# Altium schematic sheet MCU_Build.SchDoc
size A3; SheetNumber: 1; SheetTotal: 2
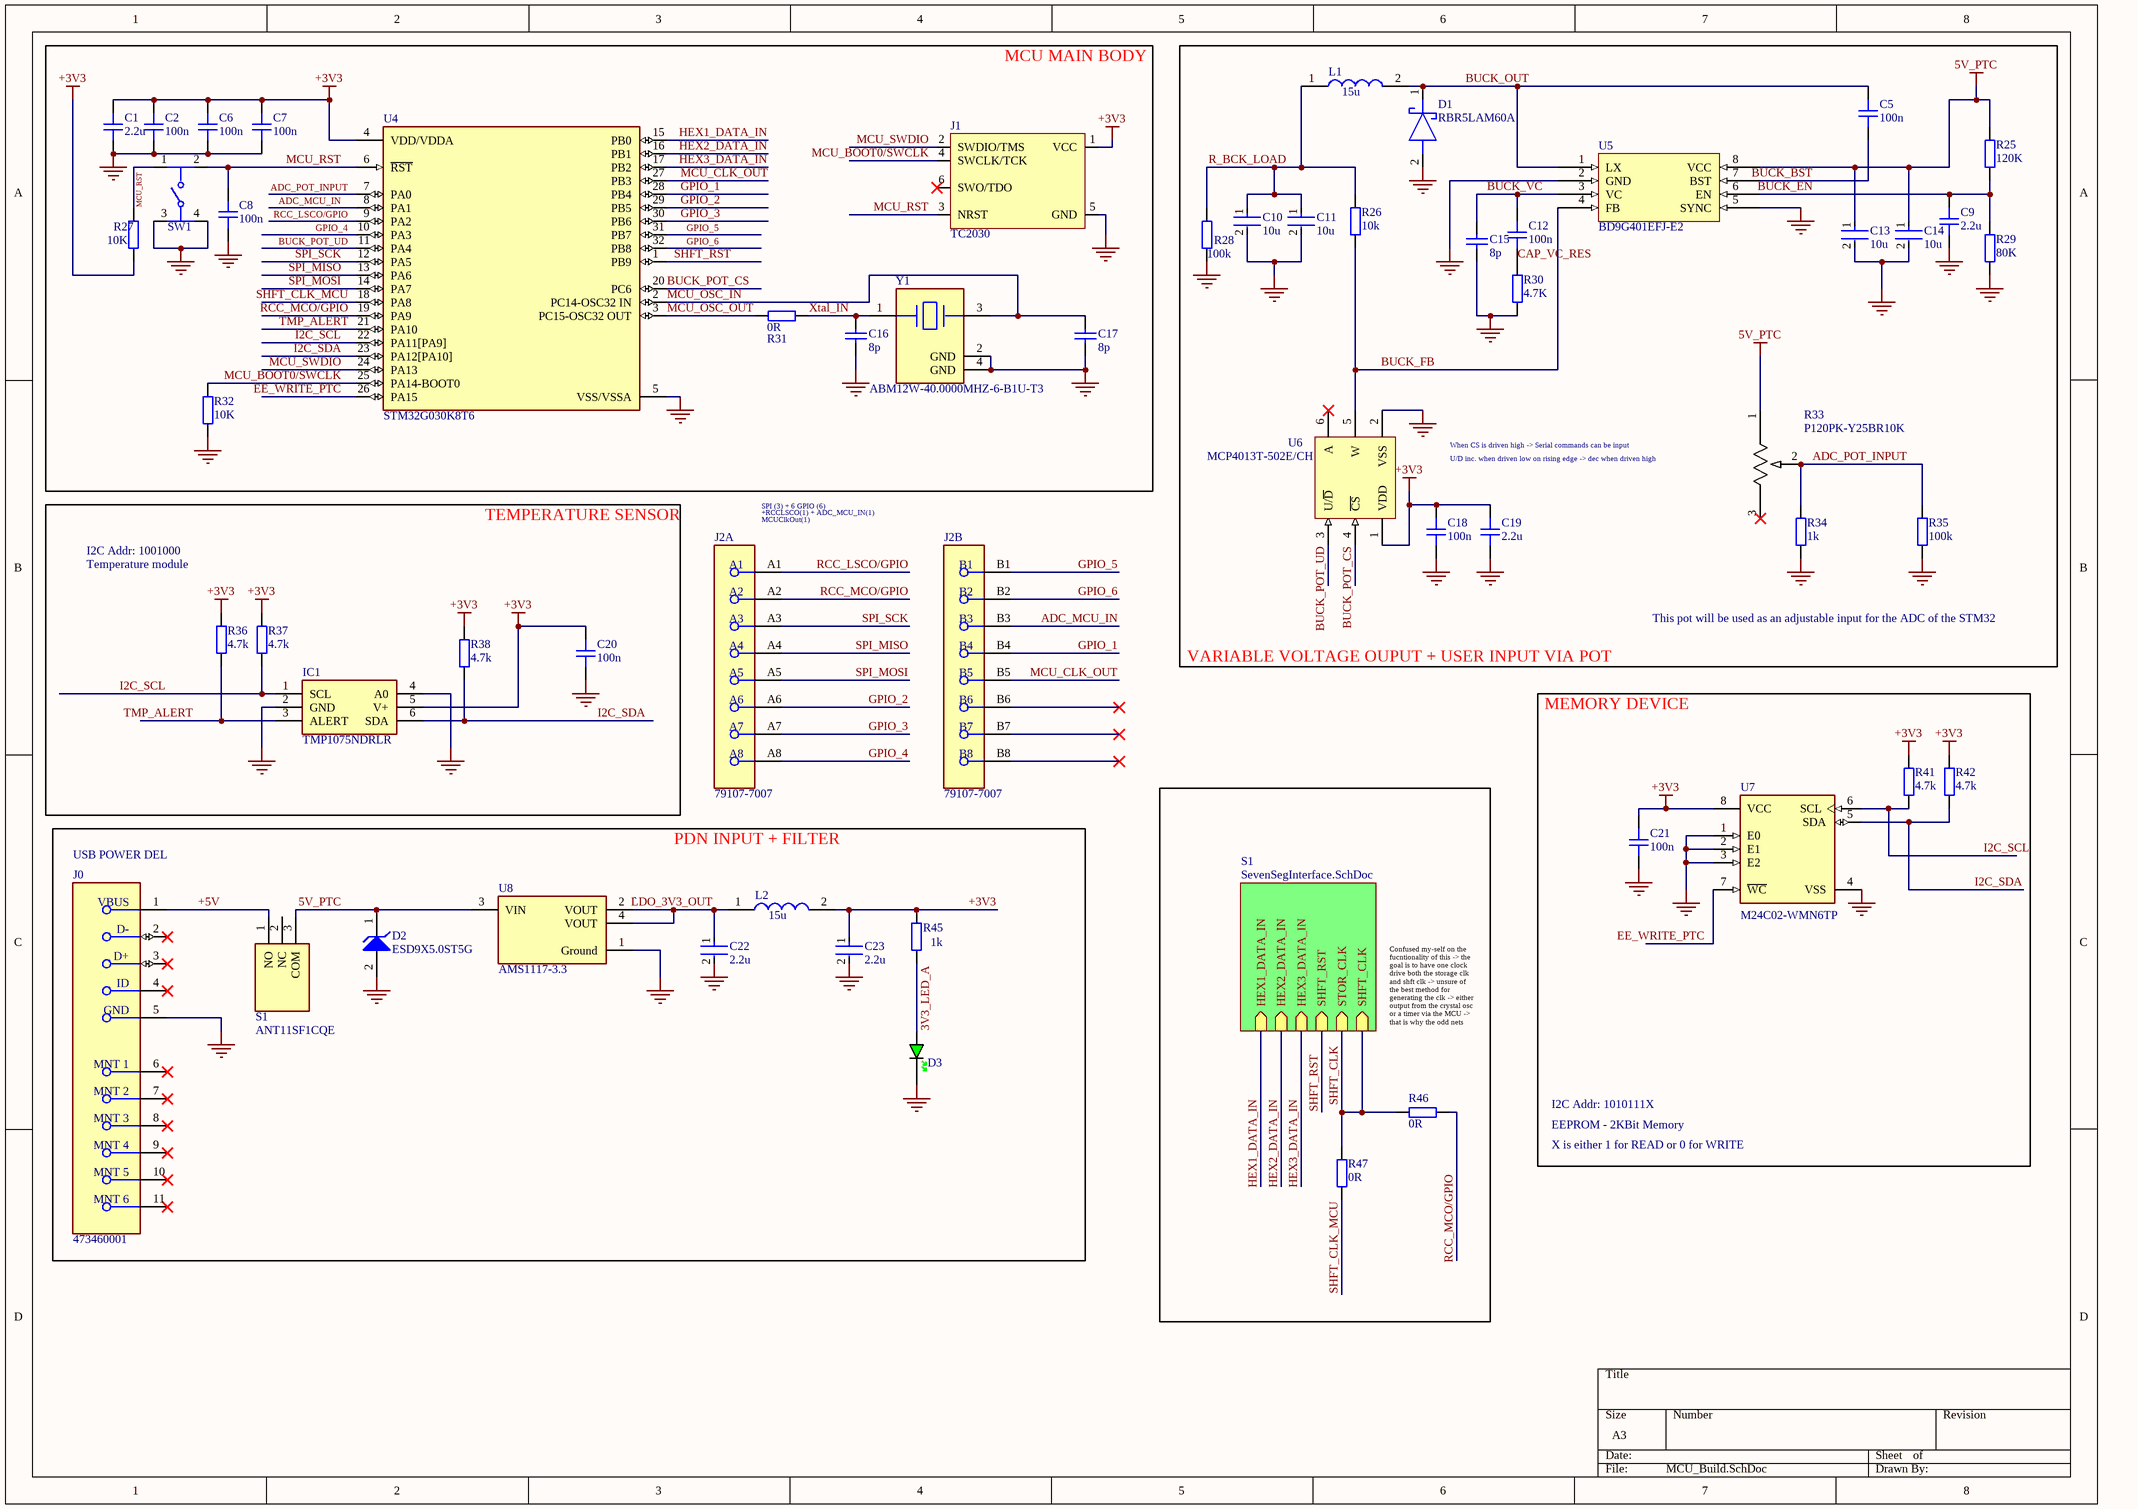
[diagram p0: MCU_Build.SchDoc]

## Parts
C1  2.2u  [CAP_0603]
C2  100n  [CAP_0402]
C5  100n  [CAP_0402]
C6  100n  [CAP_0402]
C7  100n  [CAP_0402]
C8  100n  [CAP_0402]
C9  2.2u  [CAP_0603]
C10  10u  [FP-CL31-IPC_B]
C11  10u  [FP-CL31-IPC_B]
C12  100n  [CAP_0402]
C13  10u  [FP-CL31-IPC_B]
C14  10u  [FP-CL31-IPC_B]
C15  8p  [CAPC1005X55X25LL05T10]
C16  8p  [CAPC1005X55X25LL05T10]
C17  8p  [CAPC1005X55X25LL05T10]
C18  100n  [CAP_0402]
C19  2.2u  [CAP_0603]
C20  100n  [CAP_0402]
C21  100n  [CAP_0402]
C22  2.2u  [FP-CL31-IPC_B]
C23  2.2u  [FP-CL31-IPC_B]
D1  RBR5LAM60A  [RF071LAM4S]
D2  ESD9X5.0ST5G  [ONSC-SOD-923-2-514AA-01_V]
D3  GREEN  [LED_0805_GREEN]  (value not drawn)
IC1  TMP1075NDRLR  [SOTFL50P160X60-6N]
J0  473460001  [FP-473460001-MFG]
J1  TC2030  [TC2030-FP]  (no BOM)
J2  79107-7007  [FP-79107-7007-MFG]  (parts A,B of 2)
L1  15u  [ASPI-4030S]
L2  15u  [ASPI-4030S]
R25  120K  [RES_0402]
R26  10k  [RES_0402]
R27  10K  [RES_0402]
R28  100k  [RES_0402]
R29  80K  [RES_0402]
R30  4.7K  [RES_0402]
R31  0R  [RES_0402]
R32  10K  [RES_0402]
R33  P120PK-Y25BR10K  [POT_P120PK-x25_TTE]
R34  1k  [RES_0402]
R35  100k  [RES_0402]
R36  4.7k  [RES_0402]
R37  4.7k  [RES_0402]
R38  4.7k  [RES_0402]
R41  4.7k  [RES_0402]
R42  4.7k  [RES_0402]
R45  1k  [RES_0402]
R46  0R  [RES_0402]
R47  0R  [RES_0402]
S1  ANT11SF1CQE  [ANT11SF1CQE]
SW1  PTS810SJM250SMTRLFS  [FP-PTS810SJM250SMTRLFS-MFG]  (value not drawn)
U4  STM32G030K8T6  [FP-LQFP32-5V-IPC_A]
U5  BD9G401EFJ-E2  [SOIC127P600X100_HS-9N]
U6  MCP4013T-502E/CH  [SOT-23-CH6_N]
U7  M24C02-WMN6TP  [FP-SO8N-SO-A-MFG]
U8  AMS1117-3.3  [FP-AMS1117-IPC_C]
Y1  ABM12W-40.0000MHZ-6-B1U-T3  [FP-ABM12W-MFG]

## Blocks framed on the sheet
MCU MAIN BODY: C1 C2 C6-C8 C16 C17 J1 R27 R31 R32 SW1 U4 Y1
VARIABLE VOLTAGE OUPUT + USER INPUT VIA POT: C5 C9-C15 C18 C19 D1 L1 R25 R26 R28-R30 R33-R35 U5 U6
TEMPERATURE SENSOR: C20 IC1 R36-R38
MEMORY DEVICE: C21 R41 R42 U7
PDN INPUT + FILTER: C22 C23 D2 D3 J0 L2 R45 S1 U8

## Sub-sheets
S1 = SevenSegInterface.SchDoc: SHFT_CLK (in), STOR_CLK (in), SHFT_RST (in), HEX3_DATA_IN (in), HEX2_DATA_IN (in), HEX1_DATA_IN (in)

## Nets
5V_PTC: C13.1 C14.1 D2.1(K) R25.2 R33.1 S1.3(COM) U5.8(VCC) U8.3(VIN)
+3V3: C1.2 C2.2 C6.2 C7.2 C18.2 C19.2 C20.2 C21.2 C23.1 IC1.5(V+) J1.1(VCC) L2.2 R27.2 R36.1 R37.1 R38.1 R41.1 R42.1 R45.1 U4.4(VDD/VDDA) U6.1(VDD) U7.8(VCC)
GND: C1.1 C2.1 C6.1 C7.1 C8.1 C9.1 C10.2 C11.2 C13.2 C14.2 C15.1 C16.1 C17.1 C18.1 C19.1 C20.1 C21.1 C22.2 C23.2 D1.2(A) D2.2(A) D3.K IC1.2(GND) IC1.4(A0) J0.5(GND) J1.5(GND) R28.1 R29.1 R30.1 R32.2 R34.1 R35.1 SW1.3 SW1.4 U4.5(VSS/VSSA) U5.2(GND) U5.5(SYNC) U6.2(VSS) U7.1(E0) U7.2(E1) U7.3(E2) U7.4(VSS) U8.1(Ground) Y1.2(GND) Y1.4(GND)
3V3_LED_A: D3.A R45.2
+5V: J0.1(VBUS) S1.1(NO)
ADC_MCU_IN: J2.B3 U4.8(PA1)
ADC_POT_INPUT: R33.2 R34.2 R35.2 U4.7(PA0)
BUCK_BST: C5.1 U5.7(BST)
BUCK_EN: C9.2 R25.1 R29.2 U5.6(EN)
BUCK_FB: R26.1 U5.4(FB) U6.5(W)
BUCK_OUT: C5.2 D1.1(K) L1.2 U5.1(LX)
BUCK_POT_CS: U4.20(PC6) U6.4(~{CS})
BUCK_POT_UD: U4.11(PA4) U6.3(U/~{D})
BUCK_VC: C12.2 C15.2 U5.3(VC)
CAP_VC_RES: C12.1 R30.2
EE_WRITE_PTC: U4.26(PA15) U7.7(~{WC})
GPIO_1: J2.B4 U4.28(PB4)
GPIO_2: J2.A6 U4.29(PB5)
GPIO_3: J2.A7 U4.30(PB6)
GPIO_4: J2.A8 U4.10(PA3)
GPIO_5: J2.B1 U4.31(PB7)
GPIO_6: J2.B2 U4.32(PB8)
HEX1_DATA_IN: U4.15(PB0) ; sheet S1/HEX1_DATA_IN
HEX2_DATA_IN: U4.16(PB1) ; sheet S1/HEX2_DATA_IN
HEX3_DATA_IN: U4.17(PB2) ; sheet S1/HEX3_DATA_IN
I2C_SCL: IC1.1(SCL) R37.2 R41.2 U4.22(PA11[PA9]) U7.6(SCL)
I2C_SDA: IC1.6(SDA) R38.2 R42.2 U4.23(PA12[PA10]) U7.5(SDA)
LDO_3V3_OUT: C22.1 L2.1 U8.2(VOUT) U8.4(VOUT)
MCU_BOOT0/SWCLK: J1.4(SWCLK/TCK) R32.1 U4.25(PA14-BOOT0)
MCU_CLK_OUT: J2.B5 U4.27(PB3)
MCU_OSC_IN: C17.2 U4.2(PC14-OSC32_IN) Y1.3
MCU_OSC_OUT: R31.2 U4.3(PC15-OSC32_OUT)
MCU_RST: C8.2 J1.3(NRST) R27.1 SW1.1 SW1.2 U4.6(~{RST})
MCU_SWDIO: J1.2(SWDIO/TMS) U4.24(PA13)
R_BCK_LOAD: C10.1 C11.1 L1.1 R26.2 R28.2
RCC_LSCO/GPIO: J2.A1 U4.9(PA2)
RCC_MCO/GPIO: J2.A2 R46.1 U4.19(PA9)
SHFT_CLK: R46.2 R47.1 ; sheet S1/SHFT_CLK, sheet S1/STOR_CLK
SHFT_CLK_MCU: R47.2 U4.18(PA8)
SHFT_RST: U4.1(PB9) ; sheet S1/SHFT_RST
SPI_MISO: J2.A4 U4.13(PA6)
SPI_MOSI: J2.A5 U4.14(PA7)
SPI_SCK: J2.A3 U4.12(PA5)
TMP_ALERT: IC1.3(ALERT) R36.2 U4.21(PA10)
Xtal_IN: C16.2 R31.1 Y1.1

Not connected (* = marked no-connect by the designer): J0 2(D-)* 3(D+)* 4(ID)* 6(MNT_1)* 7(MNT_2)* 8(MNT_3)* 9(MNT_4)* 10(MNT_5)* 11(MNT_6)*; J1 6(SWO/TDO)*; J2 B6* B7* B8*; R33 3*; S1 2(NC); U6 6(A)*

## Notes on the sheet
- When CS is driven high -> Serial commands can be input
- SPI (3) + 6 GPIO (6)
- +RCCLSCO(1) + ADC_MCU_IN(1)
- U/D inc. when driven low on rising edge -> dec when driven high
- I2C Addr: 1001000
- Temperature module
- (near J2) MCUClkOut(1)
- This pot will be used as an adjustable input for the ADC of the STM32
- (near J0) USB POWER DEL
- (near U8) `
- Confused my-self on the fucntionality of this -> the goal is to have one clock drive both the storage clk and shft clk -> unsure of the best method for generating the clk -> either output from the crystal osc or a timer via the MCU -> that is why the odd nets
- I2C Addr: 1010111X
- EEPROM - 2KBit Memory
- X is either 1 for READ or 0 for WRITE

## Library data of the parts
C1 C9 C19 = CAP_0603: Capacitor SMD 0603; Manufacturer: *; Manufacturer Part Number: *; Distributor Link: *; LCSC: *; Rating: *; Dielectric: *
C2 C5-C8 C12 C18 C20 C21 = CAP_0402: Capacitor SMD 0402; Manufacturer: *; Manufacturer Part Number: *; Distributor Link: *; LCSC: *; Rating: *; Dielectric: *
C10 C11 C13 C14 C22 C23 = CMP-13271-003817-1: Cap Ceramic 10uF 16V X7R ±10% SMD 1206 +125°C Embossed T/R; Lead Free: Lead Free; Package Quantity: 1; Depth: 1.6mm; Height: 1.6mm; Radiation Hardening: No; Length: 0.126inch; Thickness: 0.071inch; Case Code (Metric): 3216; Min Operating Temperature: -55°C; Packaging: Tape and Reel; Tolerance: 10%; Case Code (Imperial): 1206; Max Operating Temperature: 125°C; Capacitance: 10uF; Case/Package: 1206; Dielectric: X7R; Voltage Rating: 16V; Mount: Surface Mount; Width: 0.063inch
C15-C17 = CMP-1034-00583-2: Part Number: GRM1555C1H8R0BA01D; Manufacturer: Murata
D1 = RBR5LAM60A: Schottky Diode; Manufacturer_Name: ROHM Semiconductor; Datasheet Link: https://fscdn.rohm.com/en/products/databook/datasheet/discrete/diode/schottky_barrier/rbr5lam60atr-e.pdf; Height: 0.95mm; Manufacturer_Part_Number: RBR5LAM60A; Mouser Part Number: N/A; Mouser Price/Stock: https://www.mouser.co.uk/ProductDetail/ROHM-Semiconductor/RBR5LAM60A?qs=W0yvOO0ixfEqGw%252BcuKi1wQ%3D%3D
D2 = CMP-1063-00108-1: Transient Voltage Suppressor, Micro-Packaged Diode for ESD Protection, 2-Pin SOD-923, Pb-Free, Tape and Reel; Manufacturer: On Semiconductor; V(BR) Min (V): 6.2; VRWM Max (V): 5; Number of Lines: 1; Direction: Unidirectional; Mounting Technology: Surface Mount; PackageReference: SOD-923-2-514AA-01; RoHS: Pb-Free; PackageDescription: 2-Pin SOD, Body 0.8 x 0.6 mm; PartNumber: ESD9X5.0ST5G; IR Max (uA): 1; ComponentLink3Description: Package Specification; DatasheetVersion: Rev. 7; Packing: Tape and Reel; PackageVersion: Rev. E, 03/2011; ComponentLink3URL: http://www.onsemi.com/pub_link/Collateral/514AA.PDF; ComponentLink2Description: Datasheet; ComponentLink2URL: http://www.onsemi.cn/pub_link/Collateral/ESD9X3.3ST5G-D.PDF; ComponentLink1Description: Manufacturer URL; ComponentLink1URL: http://www.onsemi.com/
D3 = LED_0805_GREEN: LED 0805 GREEN SMD; Manufacturer: *; Manufacturer Part Number: *; Distributor Link: *; LCSC: *
IC1 = TMP1075NDRLR: Integrated Circuit; Manufacturer_Name: Texas Instruments; Datasheet Link: https://www.ti.com/lit/ds/symlink/tmp1075.pdf?ts=1637475227880&ref_url=https%253A%252F%252Fwww.ti.com%252Fstore%252Fti%252Fen%252Fp%252Fproduct%252F%253Fp%253DTMP1075NDRLR; Height: 0.6mm; Manufacturer_Part_Number: TMP1075NDRLR; Mouser Part Number: 595-TMP1075NDRLR; Mouser Price/Stock: https://www.mouser.co.uk/ProductDetail/Texas-Instruments/TMP1075NDRLR?qs=Wj%2FVkw3K%252BMAzhq67b4cIAg%3D%3D; Arrow Part Number: TMP1075NDRLR; Arrow Price/Stock: https://www.arrow.com/en/products/tmp1075ndrlr/texas-instruments?utm_currency=USD&region=nac
J0 = CMP-2000-05246-2: CONN RCPT USB2.0 MICRO B SMD R/A; Manufacturer: Molex; Conn Orientation: Right Angle; Is Female: yes; Shielding: true; Pitch: 0.65mm; Number Of Contacts: 5; Voltage Rating: 30V; Current Rating: 1.8A; Device Class L2: USB Connectors; Digikey Description: CONN RCPT USB2.0 MICRO B SMD R/A; Height: 2.945mm; RoHS: TRUE; ComponentLink2Description: Datasheet; Octopart: https://octopart.com/47346-0001-molex-7164928; Automotive: No; Package: 0; Category: Conn; Device Class L1: Connectors; Usb Standard: USB 2.0; Temperature: -30°C to +85°C; Temperature Range Low: -30°C; Footprint Url: https://www.molex.com/pdm_docs/sd/473460001_sd.pdf; ComponentLink2URL: https://www.molex.com/webdocs/datasheets/pdf/en-us/0473460001_IO_CONNECTORS.pdf; Lead Free: Yes; Manufacturer Part Number: 473460001; Contact Material: Gold,Nickel; Temperature Range High: +85°C; Device Class L3: unset
J1 = CMP-002-00074-1: Tag-Connect No-Solder SWD Debug Connector DO NOT PLACE; Source: Schematic-Lib-PhilsLab.SchLib; Design Item ID: TC2030; Manufacturer Part Number: TC2030; Manufacturer: Tag-Connect
J2 = CMP-00257-00277158-2: 79107-7007 Conn Socket Strip RCP 16 POS 2mm Solder ST Top Entry Thru-Hole Milli-Grid™ Tube; Manufacturer Lifecycle Status: ACTIVE; NexarPartId: 277158; Number of Circuits: 16; Plating: Tin; Current Rating: 1A; Glow Wire Compliant: Non-compliant; Voltage Rating: 125V; Contact Resistance: 25mΩ; Gender: Receptacle; Schedule B: 8536694040, 8536694040; Contact Plating: Gold; Radiation Hardening: No; Mount: Through Hole; Housing Color: Black; Housing Material: Thermoplastic; Max Operating Temperature: 105°C; Pitch: 2mm; Lead Pitch: 2mm; Contact Gender: Female; Height: 4.69mm; Lifecycle Status: Production; Min Operating Temperature: -55°C; REACH SVHC: Unknown; Termination: Through Hole; Number of Positions: 16; Max Voltage Rating (AC): 125V; Contact Material: Bronze, Gold, Nickel; Orientation: Vertical; Country of Origin: US; Number of Contacts: 16; Number of Rows: 2; Lead Free: Lead Free; RoHS: Compliant
L1 L2 = ASPI-4030S-150M-T: Inductor; Manufacturer_Name: ABRACON; Datasheet Link: https://abracon.com/Magnetics/power/ASPI-4030S.pdf; Height: 3mm; Manufacturer_Part_Number: ASPI-4030S-150M-T; Mouser Part Number: 815-ASPI-4030S-150MT; Mouser Price/Stock: https://www.mouser.co.uk/ProductDetail/ABRACON/ASPI-4030S-150M-T?qs=BLmuIjeT3qFL0%2Fp0zFI3Nw%3D%3D; Arrow Part Number: ASPI-4030S-150M-T; Arrow Price/Stock: https://www.arrow.com/en/products/aspi-4030s-150m-t/abracon?region=nac
R25-R32 R34-R38 R41 R42 R45-R47 = RES_0402: Resistor SMD 0402; Manufacturer: *; Manufacturer Part Number: *; Distributor Link: *; LCSC: *
R33 = P120PK-Y25BR10K: https://www.digikey.ca/en/products/detail/tt-electronics-bi/P120PK-Y25BR10K/5957454; Mfr_Name: TT Electronics
S1 = ANT11SF1CQE: Switch; Manufacturer_Name: CIT Relay & Switch; Datasheet Link: https://www.citrelay.com/CatalogPages/SwitchCatalog/ANT.pdf; Height: 26.66mm; Manufacturer_Part_Number: ANT11SF1CQE
SW1 = CMP-10040-000001-2: SWITCH TACTILE SPST-NO 0.05A 16V; Throw Configuration: SPST; Operating Force: 160gf; Actuator Type: Standard; Switch Travel: 0.15mm; Switch Function: Off-Mom; Max Current Rating: 50mA; Mechanical Life: 150000Cycles; Illumination Type: Non-Illuminated; Package Quantity: 2900; Depth: 4.6mm; Mount: Surface Mount; Packaging: Tape and Reel; Length: 3.2mm; RoHS Compliant: Yes; Case/Package: SMD/SMT; Voltage Rating (DC): 16V; Min Operating Temperature: -40°C; Termination: J-Bend; Lead Free: Lead Free; Contact Plating: Silver; Orientation: Straight; Max Operating Temperature: 85°C; Current Rating: 50mA; Color: Black
U4 = CMP-12105-000136-1: IC MCU 32BIT 64KB FLASH 32LQFP; RoHS Compliant: Yes
U5 = BD9G401EFJ-E2: BD9G401EFJ is buck converters with built-in high side / MOSFET. It has an input voltage range of 4.5V to 42V. / Current mode architecture provides fast transient / response and a simple phase compensation setup.; ComponentLink1Description: Manufactuer Link; ComponentLink1URL: https://www.digikey.ca/en/products/detail/rohm-semiconductor/BD9G401EFJ-E2/25927541; ComponentLink2Description: Data Sheet; ComponentLink2URL: https://fscdn.rohm.com/en/products/databook/datasheet/ic/power/switching_regulator/bd9g401efj-e.pdf
U6 = CMP-0188-00742-2: Low-Cost 64-Step Volatile Digital POT, 6-Pin SOT-23, Extended Temperature, Tape and Reel; ComponentLink2Description: Datasheet; ComponentLink3Description: Package Specification; PackageDescription: 6-Lead Plastic Small Outline Transistor (CH) [SOT-23]; ComponentLink3URL: http://www.microchip.com/stellent/groups/techpub_sg/documents/packagingspec/en012702.pdf; PackageVersion: revBB, Aug-2009; PackageReference: SOT-23-CH6; ComponentLink2URL: http://ww1.microchip.com/downloads/en/DeviceDoc/21978c.pdf; ComponentLink1URL: http://www.microchip.com/; Code_IPC: SOT26A-6; RevisionNote: URLs added.; ComponentLink1Description: Manufacturer URL; DatasheetVersion: revC, Dec-2006
U7 = CMP-2000-05370-2: IC EEPROM 2K I2C 400KHZ 8SO; Manufacturer: STMicroelectronics; Min Supply Voltage: 2.5V; Standoff Height: 0.1mm; Nominal Supply Current: 0.5-1mA; Access Time: 900ns; Memory Size: 2Kbits; Max Supply Voltage: 5.5V; Digikey Description: IC EEPROM 2K I2C 400KHZ 8SO; Memory Type: EEPROM; ComponentLink2URL: https://www.st.com/resource/en/datasheet/m24c02-w.pdf; Device Class L3: EEPROM; Interface: I2C; Temperature Range High: +85°C; Mouser Description: M24C02 Series 2 Kb (256 x 8) 2.5 V SMT Serial I²C Bus EEPROM - SOIC-8; RoHS: TRUE; Lead Free: Yes; Ambient Temperature Range Low: -40°C; Temperature: -40°C to +85°C; Device Class L1: Integrated Circuits (ICs); Temperature Range Low: -40°C; Frequency: 400kHz; Category: IC; Manufacturer Part Number: M24C02-WMN6TP; Height: 1.75mm; Octopart: https://octopart.com/m24c02-wmn6tp-stmicroelectronics-55404516; Automotive: No; Ambient Temperature Range High: +85°C; ComponentLink2Description: Datasheet; Package: SO8N-SO-A; Device Class L2: Memory
U8 = CMP-209535-000001-1: LDO Voltage Regulators 1A, 3.3V; Manufacturer: Advanced Monolithic Systems; Dropout Voltage: 1.1V; Output Type: Fixed; Nominal Supply Current: 5mA; Max Power Dissipation: 1.2W; Max Supply Voltage: 15V; Number Of Outputs: 1; Standoff Height: 0.64mm; Max Junction Temp: +125°C; Height: 1.8mm; Package: AMS1117; Device Class L2: Power Management ICs; ComponentLink2Description: Datasheet; ComponentLink2URL: http://www.advanced-monolithic.com/pdf/ds1117.pdf; Category: IC; RoHS: TRUE; Automotive: No; Device Class L1: Integrated Circuits (ICs); Output Current: 1A; Device Class L3: Voltage Regulators - Linear; Temperature: -40°C to +125°C; Output Voltage: 3.3V; Manufacturer Part Number: AMS1117-3.3; Temperature Range Low: -40°C; Octopart: https://octopart.com/ams1117-3.3-advanced+monolithic+systems-25899300; Lead Free: Yes; Ipc Land Pattern Name: SOT229P700X180-4; Temperature Range High: +125°C
Y1 = CMP-27762-007054-1: Crystal 40MHz ±10ppm 6pF SMD-4 1.6mm x 1.2mm